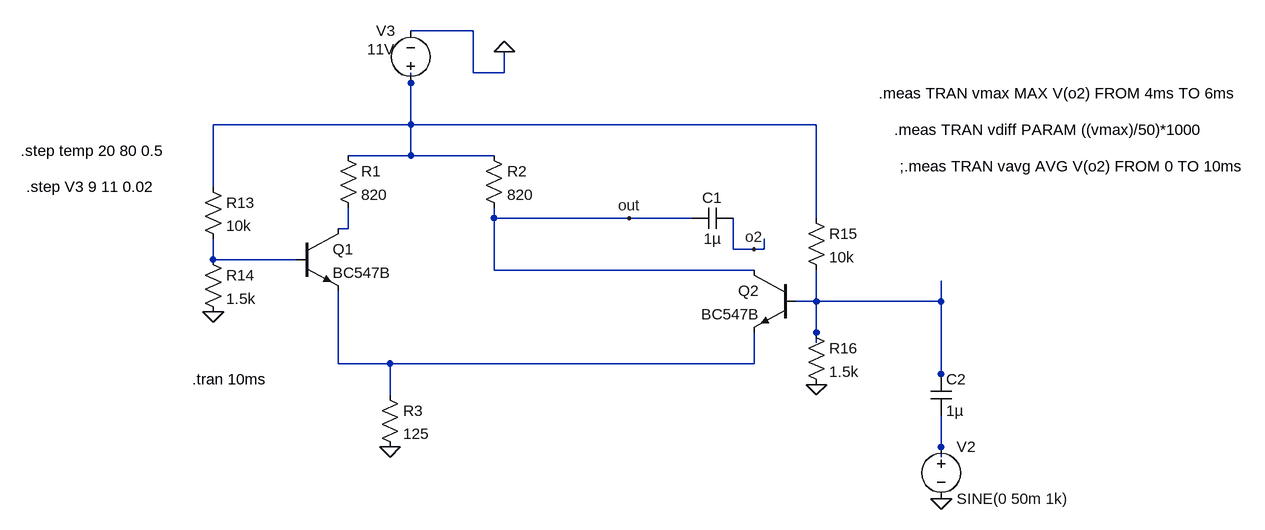
[diagram p0: schematic LtSpice.asc]
LtSpice.asc, the LTspice schematic file:
Version 4
SHEET 1 1052 680
WIRE -912 -864 -1008 -864
WIRE -912 -800 -912 -864
WIRE -864 -800 -864 -832
WIRE -864 -800 -912 -800
WIRE -1008 -784 -1008 -800
WIRE -1008 -720 -1008 -784
WIRE -1008 -720 -1312 -720
WIRE -384 -720 -1008 -720
WIRE -1008 -672 -1008 -720
WIRE -1008 -672 -1104 -672
WIRE -880 -672 -1008 -672
WIRE -1312 -624 -1312 -720
WIRE -880 -576 -880 -592
WIRE -672 -576 -880 -576
WIRE -576 -576 -672 -576
WIRE -384 -576 -384 -720
WIRE -1104 -560 -1104 -592
WIRE -1104 -560 -1120 -560
WIRE -512 -528 -512 -576
WIRE -480 -528 -512 -528
WIRE -464 -528 -464 -544
WIRE -464 -528 -480 -528
WIRE -1312 -512 -1312 -544
WIRE -1184 -512 -1312 -512
WIRE -880 -496 -880 -576
WIRE -480 -496 -880 -496
WIRE -384 -448 -384 -496
WIRE -384 -448 -416 -448
WIRE -192 -448 -192 -480
WIRE -192 -448 -384 -448
WIRE -384 -400 -384 -448
WIRE -384 -384 -384 -400
WIRE -1120 -352 -1120 -464
WIRE -1040 -352 -1120 -352
WIRE -480 -352 -480 -400
WIRE -480 -352 -1040 -352
WIRE -192 -336 -192 -448
WIRE -192 -320 -192 -336
WIRE -1040 -304 -1040 -352
WIRE -192 -224 -192 -272
WIRE -192 -208 -192 -224
FLAG -1312 -432 0
FLAG -192 -144 0
FLAG -384 -320 0
FLAG -1040 -224 0
FLAG -864 -832 0
FLAG -672 -576 out
FLAG -480 -528 o2
SYMBOL res -1328 -528 R0
SYMATTR InstName R14
SYMATTR Value 1.5k
SYMBOL res -1328 -640 R0
SYMATTR InstName R13
SYMATTR Value 10k
SYMBOL voltage -1008 -768 R180
WINDOW 0 24 96 Left 2
WINDOW 3 24 68 Left 2
WINDOW 123 0 0 Left 0
WINDOW 39 0 0 Left 0
SYMATTR InstName V3
SYMATTR Value 11V
SYMBOL res -1120 -688 R0
SYMATTR InstName R1
SYMATTR Value 820
SYMBOL res -896 -688 R0
SYMATTR InstName R2
SYMATTR Value 820
SYMBOL npn -1184 -560 R0
SYMATTR InstName Q1
SYMATTR Value BC547B
SYMBOL cap -512 -592 R90
WINDOW 0 0 32 VBottom 2
WINDOW 3 32 32 VTop 2
SYMATTR InstName C1
SYMATTR Value 1µ
SYMBOL res -400 -592 R0
SYMATTR InstName R15
SYMATTR Value 10k
SYMBOL res -400 -416 R0
SYMATTR InstName R16
SYMATTR Value 1.5k
SYMBOL cap -208 -336 R0
SYMATTR InstName C2
SYMATTR Value 1µ
SYMBOL voltage -192 -240 R0
WINDOW 123 24 44 Left 2
WINDOW 39 0 0 Left 0
SYMATTR InstName V2
SYMATTR Value SINE(0 50m 1k)
SYMBOL npn -416 -496 M0
SYMATTR InstName Q2
SYMATTR Value BC547B
SYMBOL res -1056 -320 R0
SYMATTR InstName R3
SYMATTR Value 125
TEXT -1344 -328 Left 2 !.tran 10ms
TEXT -288 -768 Left 2 !.meas TRAN vmax MAX V(o2) FROM 4ms TO 6ms
TEXT -264 -712 Left 2 !.meas TRAN vdiff PARAM ((vmax)/50)*1000
TEXT -1608 -680 Left 2 !.step temp 20 80 0.5
TEXT -256 -656 Left 2 !;.meas TRAN vavg AVG V(o2) FROM 0 TO 10ms
TEXT -1600 -624 Left 2 !.step V3 9 11 0.02

The netlist it stands for:
* LtSpice.asc
R14 N003 0 1.5k
R13 N001 N003 10k
V3 N001 0 11V
R1 N001 N002 820
R2 N001 out 820
Q1 N002 N003 N005 0 BC547B
C1 o2 out 1µ
R15 N001 N004 10k
R16 N004 0 1.5k
C2 N004 N006 1µ
V2 N006 0 SINE(0 50m 1k)
Q2 out N004 N005 0 BC547B
R3 N005 0 125
.model NPN NPN
.model PNP PNP
.lib standard.bjt
.tran 10ms
.meas TRAN vmax MAX V(o2) FROM 4ms TO 6ms
.meas TRAN vdiff PARAM ((vmax)/50)*1000
.step temp 20 80 0.5
;.meas TRAN vavg AVG V(o2) FROM 0 TO 10ms
.step V3 9 11 0.02
.backanno
.end